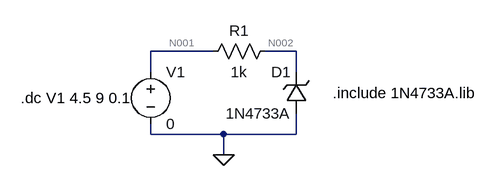
[diagram p0: schematic ZENER_REVERSE.asc]
ZENER_REVERSE.asc, the LTspice schematic file:
Version 4.1
SHEET 1 880 680
WIRE 192 96 96 96
WIRE 320 96 272 96
WIRE 96 128 96 96
WIRE 320 128 320 96
WIRE 96 224 96 208
WIRE 208 224 96 224
WIRE 320 224 320 192
WIRE 320 224 208 224
WIRE 208 256 208 224
FLAG 208 256 0
SYMBOL voltage 96 112 R0
SYMATTR InstName V1
SYMATTR Value 0
SYMBOL res 288 80 R90
WINDOW 0 0 56 VBottom 2
WINDOW 3 32 56 VTop 2
SYMATTR InstName R1
SYMATTR Value 1k
SYMBOL zener 336 192 R180
WINDOW 0 24 64 Left 2
WINDOW 3 24 0 Left 2
SYMATTR InstName D1
SYMATTR Value 1N4733A
TEXT 376 160 Left 2 !.include 1N4733A.lib
TEXT -104 168 Left 2 !.dc V1 4.5 9 0.1

The netlist it stands for:
* ZENER_REVERSE.asc
V1 N001 0 0
R1 N002 N001 1k
D1 0 N002 1N4733A
.model D D
.lib standard.dio
.include 1N4733A.lib
.dc V1 4.5 9 0.1
.backanno
.end

* Results of the author's LTspice run, read from the files saved beside the schematic
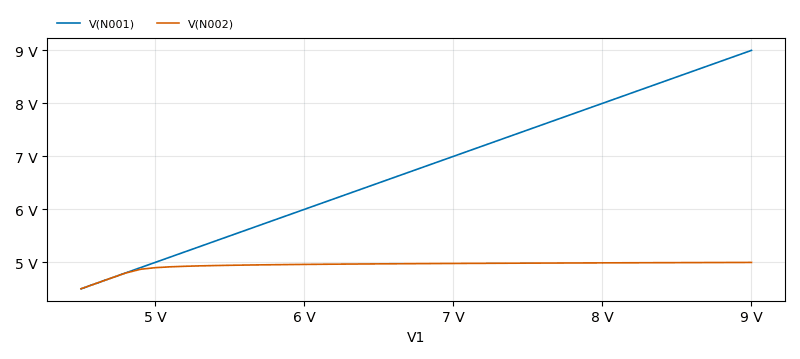
[diagram p1: DC transfer characteristic of ZENER_REVERSE.asc, plotted from the saved traces]
* DC transfer characteristic, 1 run:
*   V(N001): 4.5 V at V1=4.5 V, 9 V at V1=9 V, min 4.5 V, max 9 V
*   V(N002): 4.5 V at V1=4.5 V, 4.998 V at V1=9 V, min 4.5 V, max 4.998 V